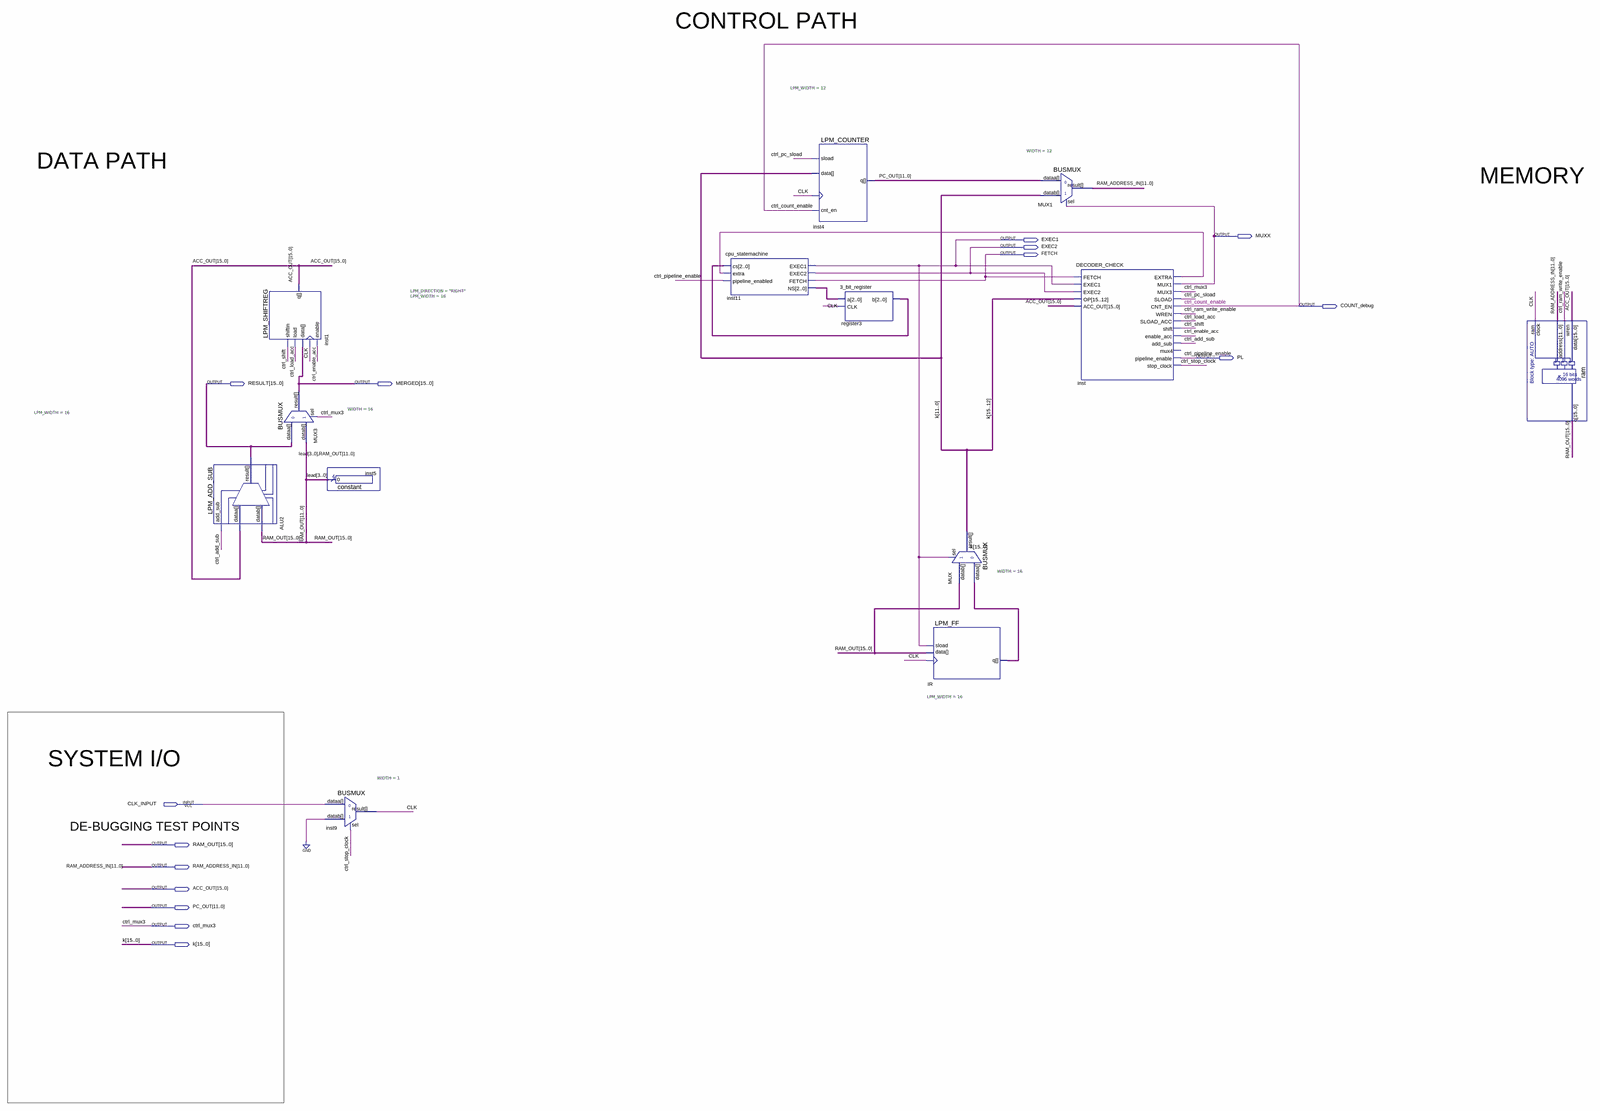
[diagram p0: schematic sheet, whole]
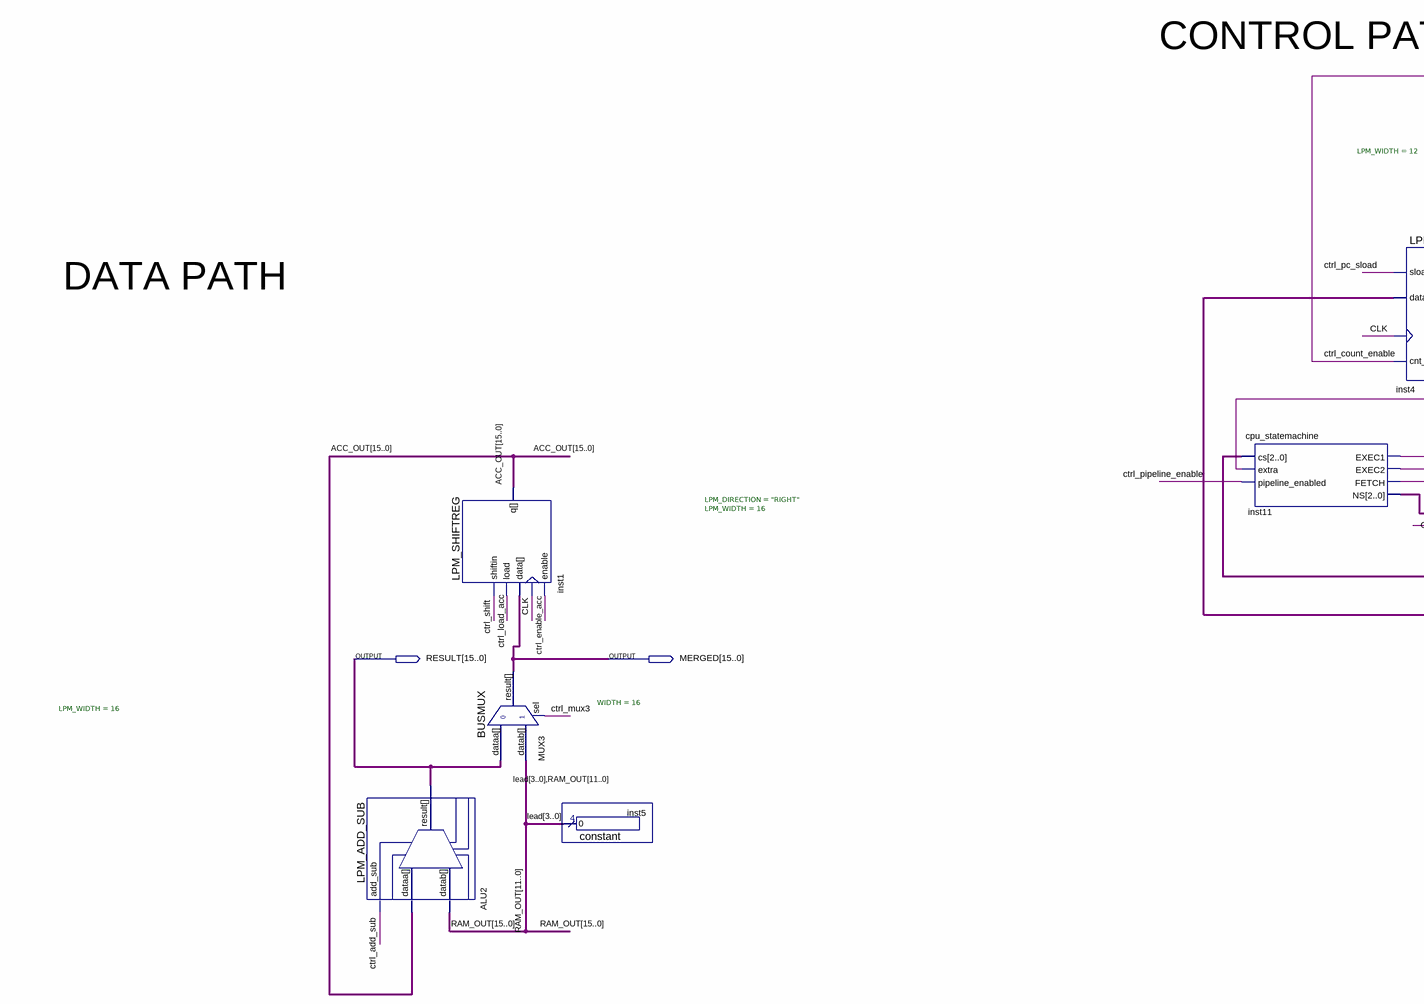
[diagram p1: schematic sheet, upper left part]
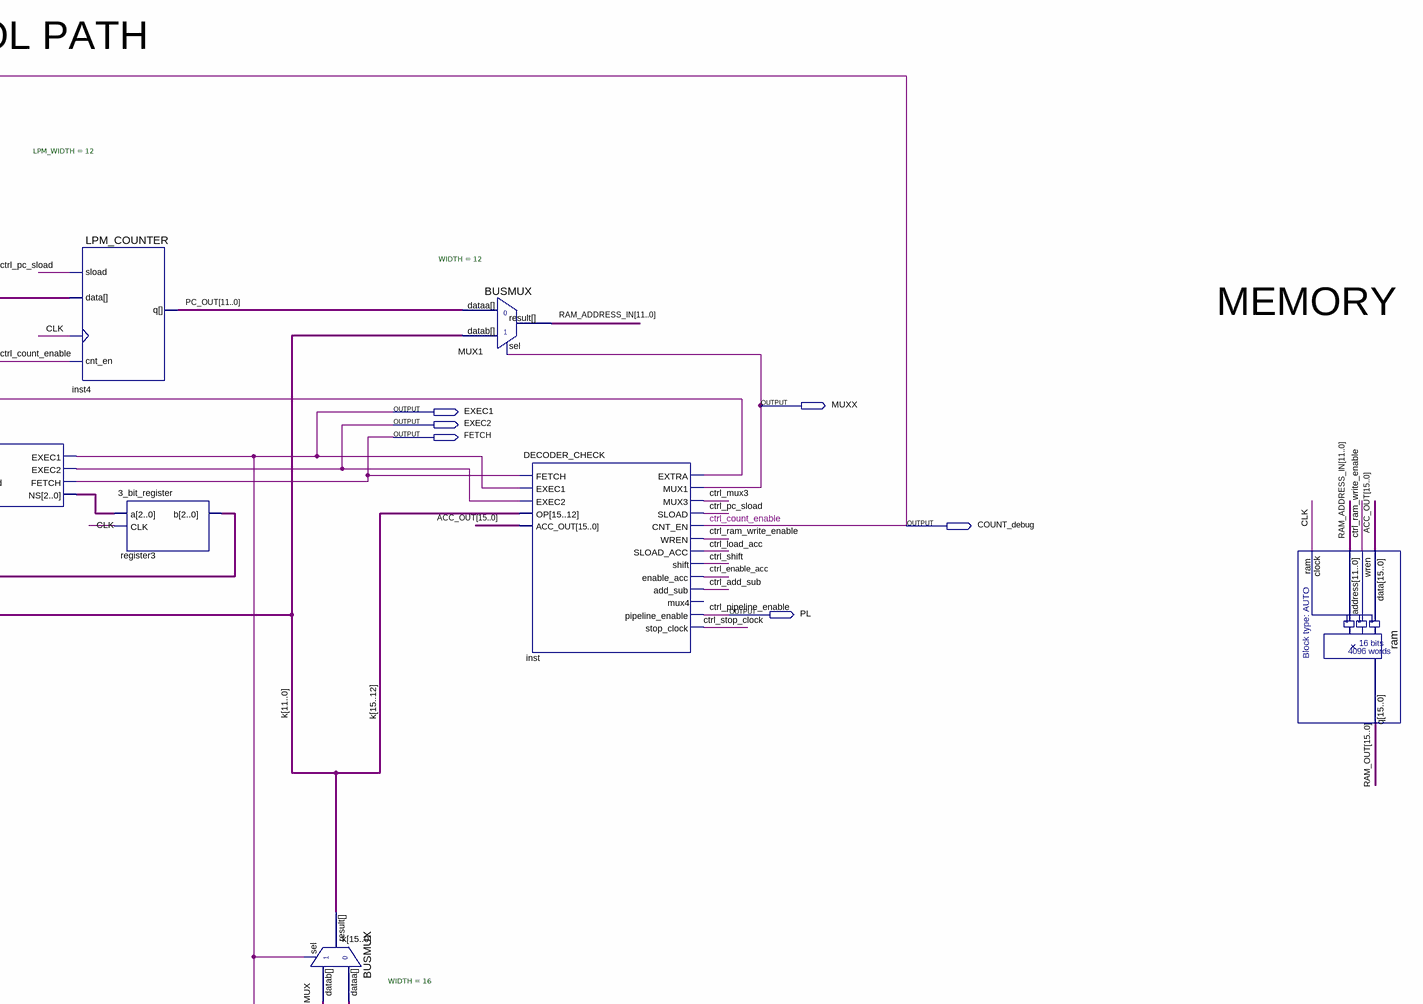
[diagram p2: schematic sheet, upper right part]
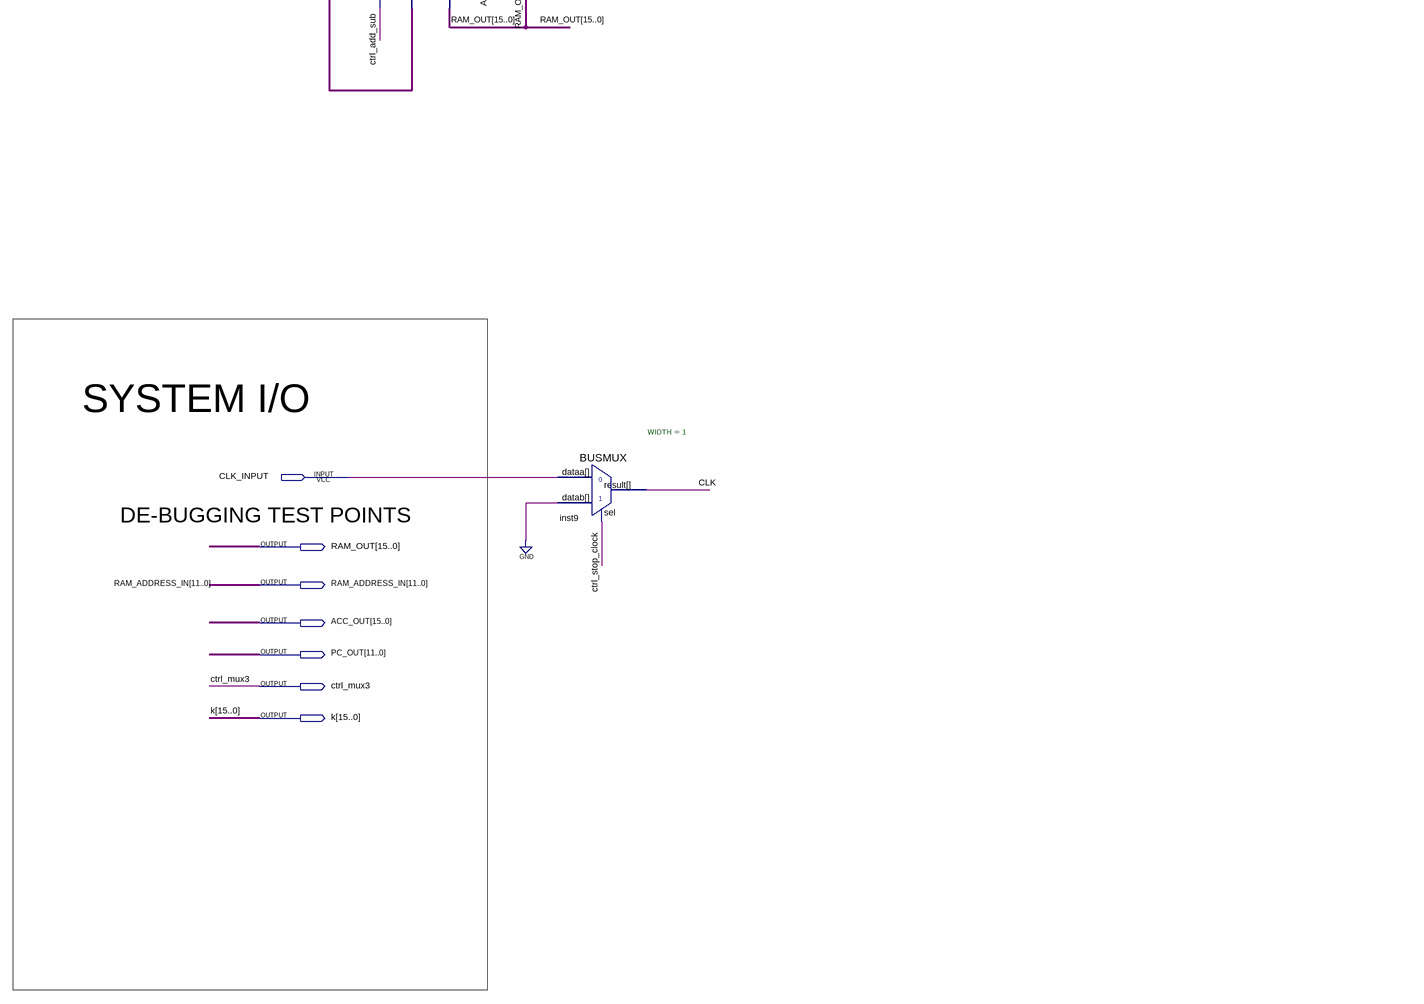
[diagram p3: schematic sheet, lower left part]
// Quartus schematic MU0CPU.bdf as structural Verilog: 13 symbols, 15 pins
module MU0CPU (
  input  CLK_INPUT,
  output MUXX,
  output EXEC1,
  output EXEC2,
  output FETCH,
  output COUNT_debug,
  output PL,
  output [15:0] RESULT,
  output [15:0] MERGED,
  output [15:0] RAM_OUT,
  output [11:0] RAM_ADDRESS_IN,
  output [15:0] ACC_OUT,
  output [11:0] PC_OUT,
  output ctrl_mux3,
  output [15:0] k
);

  wire CLK, ctrl_add_sub, ctrl_enable_acc, ctrl_load_acc, ctrl_pc_sload, ctrl_ram_write_enable, ctrl_shift,
       ctrl_stop_clock, inst_extra;
  wire [2:0] inst11_ns, register3_b;
  wire [3:0] lead;
  wire [15:0] IR_q;

  LPM_ADD_SUB #(.LPM_WIDTH(16)) ALU2 (.add_sub(ctrl_add_sub), .dataa(ACC_OUT), .datab(RAM_OUT), .result(RESULT));
  LPM_SHIFTREG #(.LPM_DIRECTION("RIGHT"), .LPM_WIDTH(16)) inst1 (
    .clock(CLK), .data(MERGED), .enable(ctrl_enable_acc), .load(ctrl_load_acc), .shiftin(ctrl_shift),
    .q(ACC_OUT));
  BUSMUX #(.WIDTH(16)) MUX3 (.datab({lead, RAM_OUT[11:0]}), .sel(ctrl_mux3), .dataa(RESULT), .result(MERGED));
  constant inst5 (.result(lead));
  BUSMUX #(.WIDTH(1)) inst9 (.datab(1'b0), .sel(ctrl_stop_clock), .dataa(CLK_INPUT), .result(CLK));
  cpu_statemachine inst11 (
    .cs(register3_b), .extra(inst_extra), .pipeline_enabled(PL), .EXEC1(EXEC1), .EXEC2(EXEC2), .FETCH(FETCH),
    .NS(inst11_ns));
  LPM_COUNTER #(.LPM_WIDTH(12)) inst4 (
    .clock(CLK), .cnt_en(COUNT_debug), .data(k[11:0]), .sload(ctrl_pc_sload), .q(PC_OUT));
  \3_bit_register  register3 (.a(inst11_ns), .CLK(CLK), .b(register3_b));
  BUSMUX #(.WIDTH(16)) MUX (.datab(RAM_OUT), .sel(EXEC1), .dataa(IR_q), .result(k));
  LPM_FF #(.LPM_WIDTH(16)) IR (.clock(CLK), .data(RAM_OUT), .sload(EXEC1), .q(IR_q));
  BUSMUX #(.WIDTH(12)) MUX1 (.datab(k[11:0]), .sel(MUXX), .dataa(PC_OUT), .result(RAM_ADDRESS_IN));
  DECODER_CHECK inst (
    .FETCH(FETCH), .EXEC1(EXEC1), .EXEC2(EXEC2), .OP(k[15:12]), .ACC_OUT(ACC_OUT), .EXTRA(inst_extra),
    .MUX1(MUXX), .MUX3(ctrl_mux3), .SLOAD(ctrl_pc_sload), .CNT_EN(COUNT_debug), .WREN(ctrl_ram_write_enable),
    .SLOAD_ACC(ctrl_load_acc), .shift(ctrl_shift), .enable_acc(ctrl_enable_acc), .add_sub(ctrl_add_sub),
    .pipeline_enable(PL), .stop_clock(ctrl_stop_clock));  // open: mux4
  ram ram (.data(ACC_OUT), .wren(ctrl_ram_write_enable), .address(RAM_ADDRESS_IN), .clock(CLK), .q(RAM_OUT));

  // Other names for the same wires on the sheet: ctrl_count_enable = COUNT_debug; ctrl_pipeline_enable = PL

  // Notes on the sheet:
  //   CONTROL PATH
  //   DATA PATH
  //   MEMORY
  //   SYSTEM I/O
  //   DE-BUGGING TEST POINTS
endmodule
